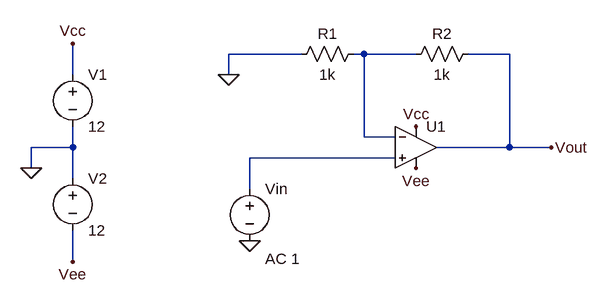
[diagram p0: schematic Draft3.asc]
Draft3.asc, the LTspice schematic file:
Version 4
SHEET 1 880 680
WIRE -5984 -7136 -6096 -7136
WIRE -5888 -7136 -5904 -7136
WIRE -5808 -7136 -5888 -7136
WIRE -5664 -7136 -5728 -7136
WIRE -6336 -7104 -6336 -7152
WIRE -6096 -7104 -6096 -7136
WIRE -5888 -7008 -5888 -7136
WIRE -5840 -7008 -5888 -7008
WIRE -6336 -6992 -6336 -7024
WIRE -6336 -6992 -6400 -6992
WIRE -5664 -6992 -5664 -7136
WIRE -5664 -6992 -5776 -6992
WIRE -5600 -6992 -5664 -6992
WIRE -5840 -6976 -6064 -6976
WIRE -6400 -6960 -6400 -6992
WIRE -6336 -6944 -6336 -6992
WIRE -6064 -6928 -6064 -6976
WIRE -6336 -6816 -6336 -6864
FLAG -6064 -6848 0
FLAG -6400 -6960 0
FLAG -6096 -7104 0
FLAG -6336 -7152 Vcc
FLAG -6336 -6816 Vee
FLAG -5808 -6960 Vee
FLAG -5808 -7024 Vcc
FLAG -5600 -6992 Vout
SYMBOL voltage -6336 -7120 R0
WINDOW 123 0 0 Left 0
WINDOW 39 0 0 Left 0
SYMATTR InstName V1
SYMATTR Value 12
SYMBOL voltage -6336 -6960 R0
WINDOW 123 0 0 Left 0
WINDOW 39 0 0 Left 0
SYMATTR InstName V2
SYMATTR Value 12
SYMBOL voltage -6064 -6944 R0
WINDOW 123 24 124 Left 2
WINDOW 39 0 0 Left 0
SYMATTR InstName Vin
SYMATTR Value ""
SYMATTR Value2 AC 1
SYMBOL res -5888 -7152 R90
WINDOW 0 0 56 VBottom 2
WINDOW 3 32 56 VTop 2
SYMATTR InstName R1
SYMATTR Value 1k
SYMBOL res -5712 -7152 R90
WINDOW 0 0 56 VBottom 2
WINDOW 3 32 56 VTop 2
SYMATTR InstName R2
SYMATTR Value 1k
SYMBOL OpAmps\\UniversalOpamp2 -5808 -6992 R0
SYMATTR InstName U1

The netlist it stands for:
* Draft3.asc
V1 Vcc 0 12
V2 0 Vee 12
Vin N002 0 AC 1
R1 N001 0 1k
R2 Vout N001 1k
XU1 N002 N001 Vcc Vee Vout level.2 Avol=1Meg GBW=10Meg Slew=10Meg ilimit=25m rail=0 Vos=0 phimargin=45 en=0 enk=0 in=0 ink=0 Rin=500Meg  ; pins IN+ IN- V+ V- OUT
.lib UniversalOpamps2.sub
.backanno
.end